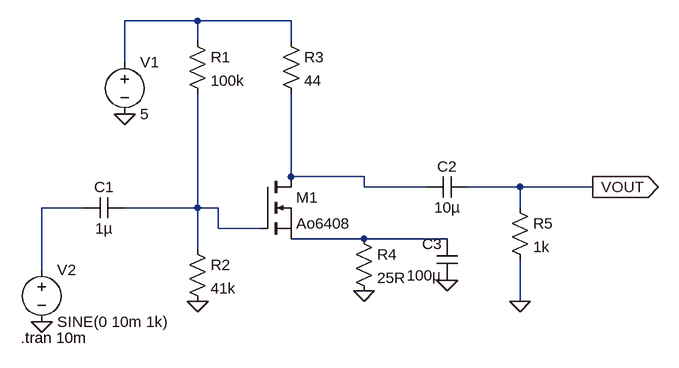
[diagram p0: schematic NNM24EE016_AnanyaN.asc]
NNM24EE016_AnanyaN.asc, the LTspice schematic file:
Version 4
SHEET 1 880 680
WIRE -16 -64 -128 -64
WIRE 128 -64 -16 -64
WIRE -16 -32 -16 -64
WIRE 128 -32 128 -64
WIRE -128 0 -128 -64
WIRE 128 176 128 48
WIRE 240 176 128 176
WIRE 240 192 240 176
WIRE 336 192 240 192
WIRE 480 192 400 192
WIRE 592 192 480 192
WIRE -192 224 -256 224
WIRE -16 224 -16 48
WIRE -16 224 -128 224
WIRE 16 224 -16 224
WIRE 480 224 480 192
WIRE 16 256 16 224
WIRE 80 256 16 256
WIRE 240 272 128 272
WIRE 368 272 240 272
WIRE -16 288 -16 224
WIRE -256 320 -256 224
WIRE 480 368 480 304
FLAG -16 368 0
FLAG -128 80 0
FLAG -256 400 0
FLAG 480 368 0
FLAG 240 352 0
FLAG 368 336 0
FLAG 592 192 VOUT
IOPIN 592 192 Out
SYMBOL res -32 -48 R0
SYMATTR InstName R1
SYMATTR Value 100k
SYMBOL res -32 272 R0
SYMATTR InstName R2
SYMATTR Value 41k
SYMBOL res 112 -48 R0
SYMATTR InstName R3
SYMATTR Value 44
SYMBOL res 224 256 R0
SYMATTR InstName R4
SYMATTR Value 25R
SYMBOL res 464 208 R0
SYMATTR InstName R5
SYMATTR Value 1k
SYMBOL nmos 80 176 R0
SYMATTR InstName M1
SYMATTR Value Ao6408
SYMBOL cap -128 208 R90
WINDOW 0 0 32 VBottom 2
WINDOW 3 32 32 VTop 2
SYMATTR InstName C1
SYMATTR Value 1µ
SYMBOL cap 400 176 R90
WINDOW 0 0 32 VBottom 2
WINDOW 3 32 32 VTop 2
SYMATTR InstName C2
SYMATTR Value 10µ
SYMBOL cap 384 336 R180
WINDOW 0 24 56 Left 2
WINDOW 3 24 8 Left 2
SYMATTR InstName C3
SYMATTR Value 100µ
SYMBOL voltage -128 -16 R0
SYMATTR InstName V1
SYMATTR Value 5
SYMBOL voltage -256 304 R0
WINDOW 123 0 0 Left 0
WINDOW 39 0 0 Left 0
SYMATTR InstName V2
SYMATTR Value SINE(0 10m 1k)
TEXT -288 424 Left 2 !.tran 10m

The netlist it stands for:
* NNM24EE016_AnanyaN.asc
R1 N001 N004 100k
R2 N004 0 41k
R3 N001 N002 44
R4 N005 0 25R
R5 VOUT 0 1k
M1 N002 N004 N005 N005 Ao6408
C1 N004 N003 1µ
C2 VOUT N002 10µ
C3 0 N005 100µ
V1 N001 0 5
V2 N003 0 SINE(0 10m 1k)
.model NMOS NMOS
.model PMOS PMOS
.lib standard.mos
.tran 10m
.backanno
.end